# EAGLE design mapleCUx_large_034 (EAGLE 6.6.0)
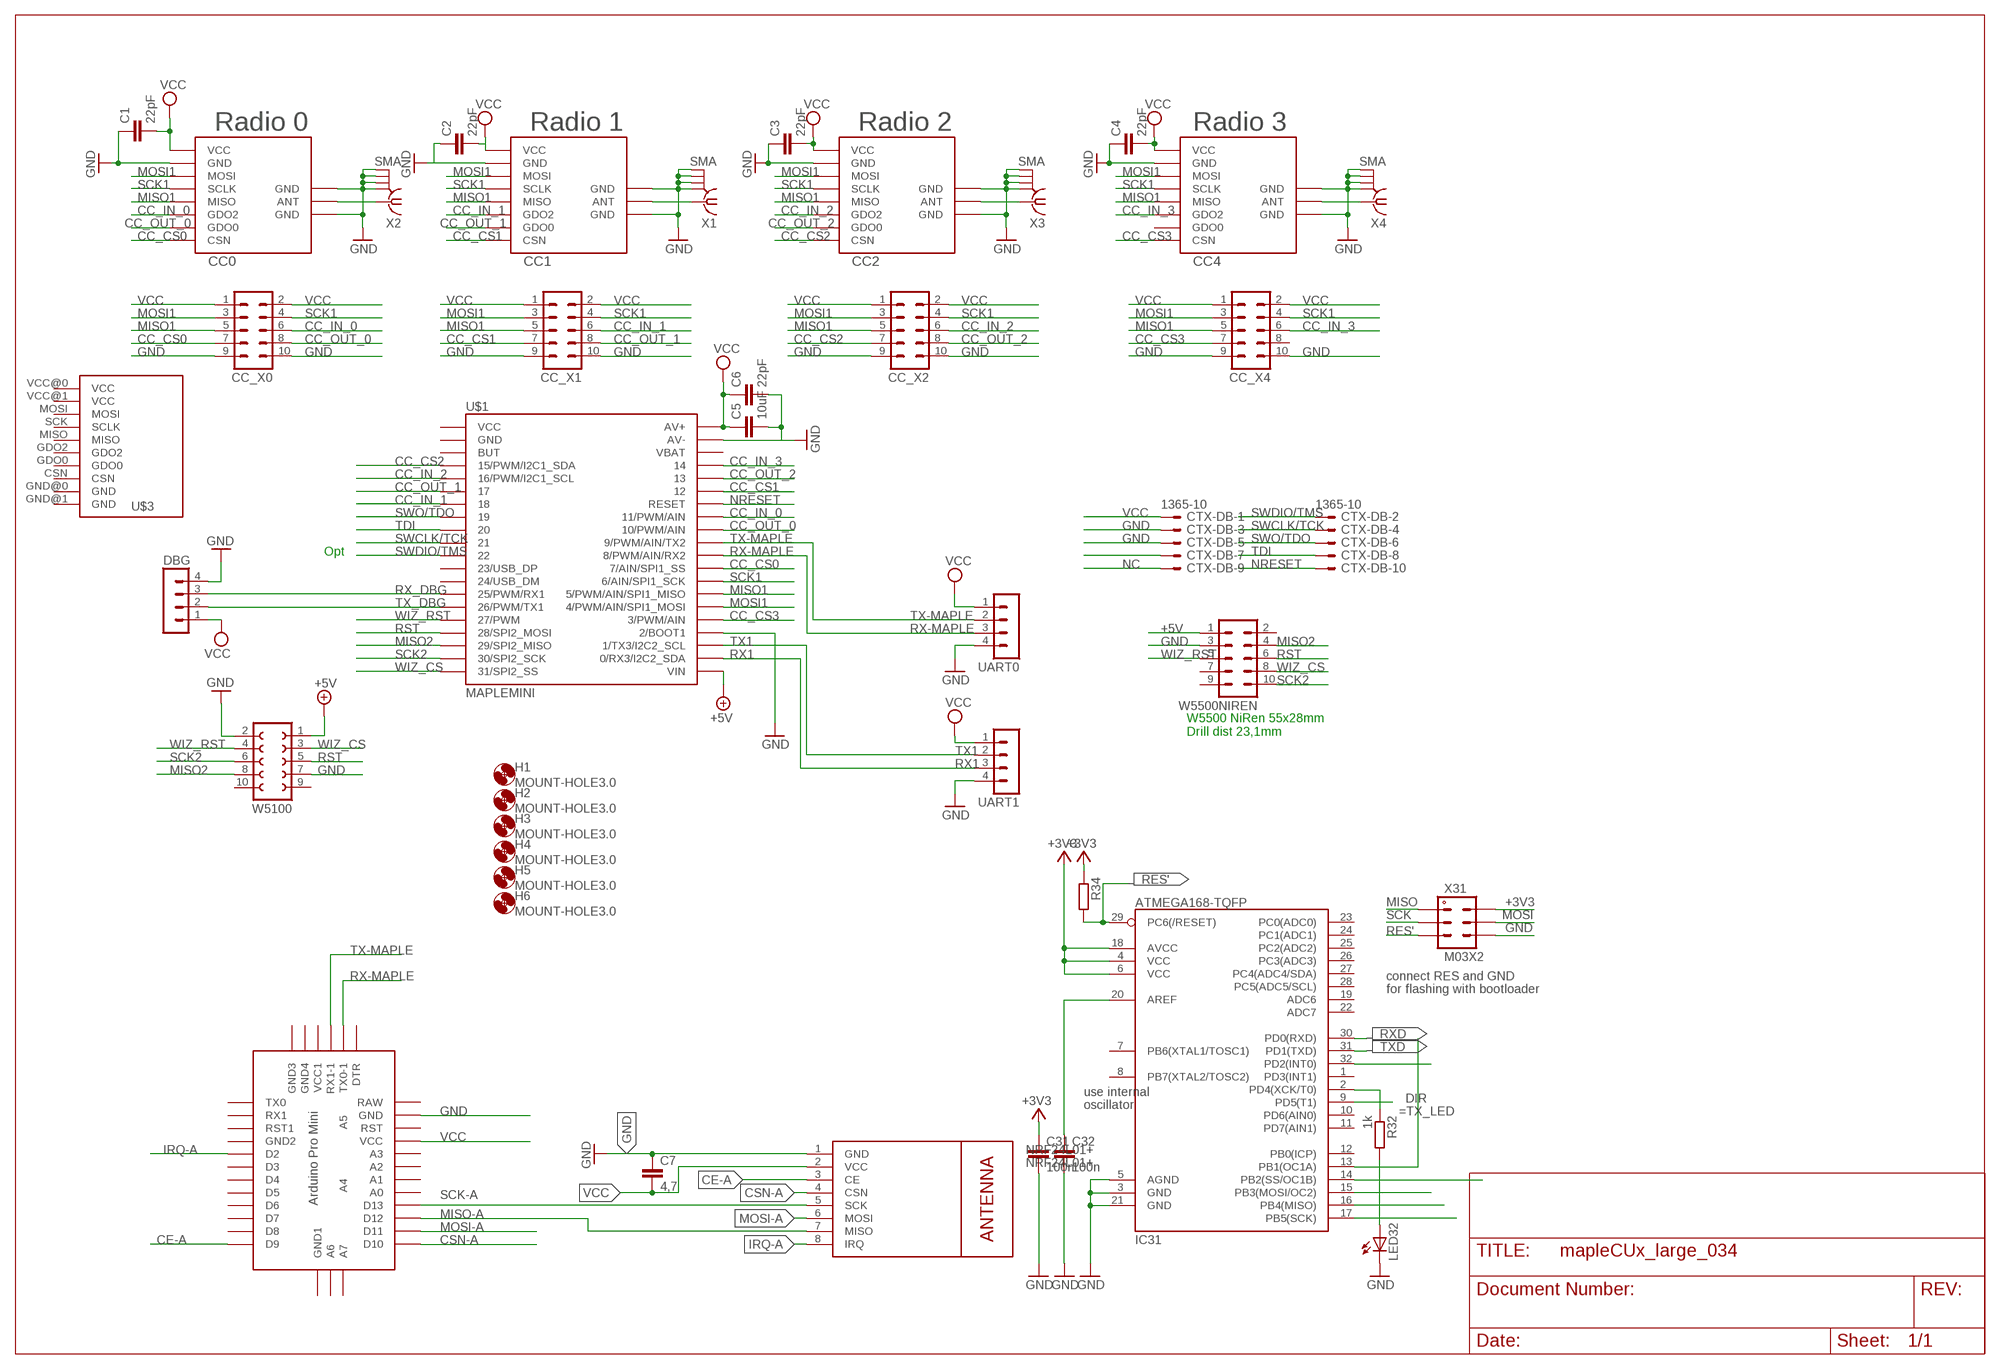
[diagram p0: schematic, sheet 1]

## Parts
C1  22pF  C-EUC0805  [C0805]
C2  22pF  C-EUC0805  [C0805]
C3  22pF  C-EUC0805  [C0805]
C4  22pF  C-EUC0805  [C0805]
C5  10uF  C-EUC1210  [C1210]
C6  22pF  C-EUC0805  [C0805]
C7  4,7  C-EUC1210  [C1210]
C31  100n  C-EUC0805  [C0805]
C32  100n  C-EUC0805  [C0805]
CC0  CC1101_MODULE1SMD  [CC1101_MODULE1_SMD]
CC1  CC1101_MODULE1SMD  [CC1101_MODULE1_SMD]
CC2  CC1101_MODULE1SMD  [CC1101_MODULE1_SMD]
CC4  CC1101_MODULE1SMD  [CC1101_MODULE1_SMD]
CC_X0  MA05-2  [MA05-2]
CC_X1  MA05-2  [MA05-2]
CC_X2  MA05-2  [MA05-2]
CC_X4  MA05-2  [MA05-2]
CTX-DB  1365-10  [1365-10]
DBG  MA04-1  [MA04-1]
H1  MOUNT-HOLE3.0  [3,0]
H2  MOUNT-HOLE3.0  [3,0]
H3  MOUNT-HOLE3.0  [3,0]
H4  MOUNT-HOLE3.0  [3,0]
H5  MOUNT-HOLE3.0  [3,0]
H6  MOUNT-HOLE3.0  [3,0]
IC31  ATMEGA168-TQFP  [TQFP32-08]
LED32  LEDCHIPLED_0805  [CHIPLED_0805]
NRF24L01+  NRF24L01+  WIRELESS-NRF24L01  [WIRELESS-NRF24L01]
R32  1k  R-EU_R0805  [R0805]
R34  R-EU_R0805  [R0805]
U$1  MAPLEMINI  [20-DIP]
U$2  ABK-PRO-MINI  [ABK-PRO-MINI]
U$3  CC1101_MODULE3_DIL  [CC1101_MODULE3_DIL]
UART0  MA04-1  [MA04-1]
UART1  MA04-1  [MA04-1]
W5100  FE05-2  [FE05-2]
W5500NIREN  MA05-2  [MA05-2]
X1  SMA  [SMA]
X2  SMA  [SMA]
X3  SMA  [SMA]
X4  SMA  [SMA]
X31  M03X2  [2X03-1.27MM_SMD]

## Nets
+3V3: C31.1 IC31.4(VCC) IC31.6(VCC) IC31.18(AVCC) R34.1 X31.P$2
+5V: U$1.21(VIN) W5100.1 W5500NIREN.1
CC_CS0: CC0.CSN CC_X0.7 U$1.29(7/AIN/SPI1_SS)
CC_CS1: CC1.CSN CC_X1.7 U$1.35
CC_CS2: CC2.CSN CC_X2.7 U$1.4(15/PWM/I2C1_SDA)
CC_CS3: CC4.CSN CC_X4.7 U$1.25(3/PWM/AIN)
CC_IN_0: CC0.GDO2 CC_X0.6 U$1.33(11/PWM/AIN)
CC_IN_1: CC1.GDO2 CC_X1.6 U$1.7
CC_IN_2: CC2.GDO2 CC_X2.6 U$1.5(16/PWM/I2C1_SCL)
CC_IN_3: CC4.GDO2 CC_X4.6 U$1.37
CC_OUT_0: CC0.GDO0 CC_X0.8 U$1.32(10/PWM/AIN)
CC_OUT_1: CC1.GDO0 CC_X1.8 U$1.6
CC_OUT_2: CC2.GDO0 CC_X2.8 U$1.36
CE-A: NRF24L01+.3(CE) U$2.D9
CS: IC31.14(PB2(SS/OC1B))
CSN-A: NRF24L01+.4(CSN) U$2.D10
DIR: IC31.9(PD5(T1))
GND: C1.1 C2.1 C3.1 C4.1 C5.2 C6.2 C7.1 C31.2 C32.2 CC0.GND@0(GND) CC0.GND@1(GND) CC0.GND@2(GND) CC1.GND@0(GND) CC1.GND@1(GND) CC1.GND@2(GND) CC2.GND@0(GND) CC2.GND@1(GND) CC2.GND@2(GND) CC4.GND@0(GND) CC4.GND@1(GND) CC4.GND@2(GND) CC_X0.9 CC_X0.10 CC_X1.9 CC_X1.10 CC_X2.9 CC_X2.10 CC_X4.9 CC_X4.10 CTX-DB.3 CTX-DB.5 DBG.4 IC31.3(GND) IC31.5(AGND) IC31.21(GND) LED32.C NRF24L01+.1(GND) U$1.24(2/BOOT1) U$1.39(AV-) U$2.GND UART0.4 UART1.4 W5100.2 W5100.7 W5500NIREN.3 X1.GND@1 X1.GND@2 X1.GND@3 X1.GND@4 X2.GND@1 X2.GND@2 X2.GND@3 X2.GND@4 X3.GND@1 X3.GND@2 X3.GND@3 X3.GND@4 X4.GND@1 X4.GND@2 X4.GND@3 X4.GND@4 X31.P$6
IRQ-A: NRF24L01+.8(IRQ) U$2.D2
MISO: IC31.16(PB4(MISO)) X31.P$1
MISO1: CC0.MISO CC1.MISO CC2.MISO CC4.MISO CC_X0.5 CC_X1.5 CC_X2.5 CC_X4.5 U$1.27(5/PWM/AIN/SPI1_MISO)
MISO2: U$1.18(29/SPI2_MISO) W5100.8 W5500NIREN.4
MISO-A: NRF24L01+.7(MISO) U$2.D12
MOSI: IC31.15(PB3(MOSI/OC2)) X31.P$4
MOSI1: CC0.MOSI CC1.MOSI CC2.MOSI CC4.MOSI CC_X0.3 CC_X1.3 CC_X2.3 CC_X4.3 U$1.26(4/PWM/AIN/SPI1_MOSI)
MOSI-A: NRF24L01+.6(MOSI) U$2.D11
N$1: CC2.ANT X3.1
N$2: CC4.ANT X4.1
N$3: CC1.ANT X1.1
N$4: CC0.ANT X2.1
N$5: LED32.A R32.2
N$6: IC31.13(PB1(OC1A))
N$8: CTX-DB.7
N$13: IC31.32(PD2(INT0))
N$15: C32.1 IC31.20(AREF)
NC: CTX-DB.9
NRESET: CTX-DB.10 U$1.34(RESET)
RES': IC31.29(PC6(/RESET)) R34.2 X31.P$5
RST: U$1.17(28/SPI2_MOSI) W5100.5 W5500NIREN.6
RX1: U$1.22(0/RX3/I2C2_SDA) UART1.3
RX-MAPLE: U$1.30(8/PWM/AIN/RX2) U$2.TX0-1 UART0.3
RX_DBG: DBG.3 U$1.14(25/PWM/RX1)
RX_LED: IC31.2(PD4(XCK/T0)) R32.1
RXD: IC31.30(PD0(RXD))
SCK: IC31.17(PB5(SCK)) X31.P$3
SCK1: CC0.SCLK CC1.SCLK CC2.SCLK CC4.SCLK CC_X0.4 CC_X1.4 CC_X2.4 CC_X4.4 U$1.28(6/AIN/SPI1_SCK)
SCK2: U$1.19(30/SPI2_SCK) W5100.6 W5500NIREN.10
SCK-A: NRF24L01+.5(SCK) U$2.D13
SWCLK/TCK: CTX-DB.4 U$1.10
SWDIO/TMS: CTX-DB.2 U$1.11
SWO/TDO: CTX-DB.6 U$1.8
TDI: CTX-DB.8 U$1.9
TX1: U$1.23(1/TX3/I2C2_SCL) UART1.2
TX-MAPLE: U$1.31(9/PWM/AIN/TX2) U$2.RX1-1 UART0.2
TX_DBG: DBG.2 U$1.15(26/PWM/TX1)
TXD: IC31.31(PD1(TXD))
VCC: C1.2 C2.2 C3.2 C4.2 C5.1 C6.1 C7.2 CC0.VCC CC1.VCC CC2.VCC CC4.VCC CC_X0.1 CC_X0.2 CC_X1.1 CC_X1.2 CC_X2.1 CC_X2.2 CC_X4.1 CC_X4.2 CTX-DB.1 DBG.1 NRF24L01+.2(VCC) U$1.40(AV+) U$2.VCC UART0.1 UART1.1
WIZ_CS: U$1.20(31/SPI2_SS) W5100.3 W5500NIREN.8
WIZ_RST: U$1.16(27/PWM) W5100.4 W5500NIREN.5
Unconnected: CC4.GDO0 CC_X4.8 IC31.1(PD3(INT1)) IC31.7(PB6(XTAL1/TOSC1)) IC31.8(PB7(XTAL2/TOSC2)) IC31.10(PD6(AIN0)) IC31.11(PD7(AIN1)) IC31.12(PB0(ICP)) IC31.19(ADC6) IC31.22(ADC7) IC31.23(PC0(ADC0)) IC31.24(PC1(ADC1)) IC31.25(PC2(ADC2)) IC31.26(PC3(ADC3)) IC31.27(PC4(ADC4/SDA)) IC31.28(PC5(ADC5/SCL)) U$1.1(VCC) U$1.2(GND) U$1.3(BUT) U$1.12(23/USB_DP) U$1.13(24/USB_DM) U$1.38(VBAT) U$2.A0 U$2.A1 U$2.A2 U$2.A3 U$2.A4 U$2.A5 U$2.A6 U$2.A7 U$2.D3 U$2.D4 U$2.D5 U$2.D6 U$2.D7 U$2.D8 U$2.DTR U$2.GND1(GND2) U$2.GND2(GND3) U$2.GND3(GND4) U$2.GND4(GND1) U$2.RAW U$2.RST U$2.RST1 U$2.RX1 U$2.TX0 U$2.VCC1 U$3.CSN U$3.GDO0 U$3.GDO2 U$3.MISO U$3.MOSI U$3.SCK(SCLK) W5100.9 W5100.10 W5500NIREN.2 W5500NIREN.7 W5500NIREN.9

## Notes on the sheet
- Radio 0 | Radio 1 | Radio 2 | Radio 3
- Opt
- W5500 NiRen 55x28mm
  Drill dist 23,1mm
- connect RES and GND
- for flashing with bootloader
- use internal
- oscillator
- =TX_LED

## Power pins joined to a net without a drawn wire
GND: U$3.GND@0(GND) U$3.GND@1(GND)
VCC: U$3.VCC@0(VCC) U$3.VCC@1(VCC)

## Library data of the parts
C1-C7 C31 C32 = rcl:C-EU: CAPACITOR, European symbol
CC0 CC1 CC2 CC4 = wireless:CC1101_MODULE1: CC1101 wireless module for 433/868 MHz (sold from Aliexpress). DIL version for mounting with pin header (and SMD soldering) and SMD only variant available.
CC_X0 CC_X1 CC_X2 CC_X4 W5500NIREN = con-lstb:MA05-2: PIN HEADER; OC_FARNELL: unknown; OC_NEWARK: unknown
CTX-DB = con-leotronics:1365-10: DUAL ROW STRAIGHT HEADER 1364 SERIES. 1.27mm x 1.27mm. Without Fixing Post. SMT Source: http://www.leotronics.co.uk/Conexcon/Data%20Sheets/sec.%20A/1364ing.pdf; OC_FARNELL: unknown; OC_NEWARK: unknown
DBG UART0 UART1 = con-lstb:MA04-1: PIN HEADER; OC_FARNELL: unknown; OC_NEWARK: unknown
H1-H6 = holes:MOUNT-HOLE: MOUNTING HOLE with drill center marker
IC31 = atmel:ATMEGA168: Atmel Atmega 168/328/328P
LED32 = led:LED: LED OSRAM: - CHIPLED LG R971, LG N971, LY N971, LG Q971, LY Q971, LO R971, LY R971 LH N974, LH R974 LS Q976, LO Q976, LY Q976 LO Q996 - Hyper CHIPLED LW Q18S LB Q993, LB Q99A, LB R99A - SideLED LS A670, LO A670, LY A670, LG A670, LP A670 LB A673, LV A673, LT A673, LW A673 LH A674 LY A675 LS A676, LA A676, LO A676, LY A676, LW A676 LS A679, LY A679, LG A679 - Hyper Micro SIDELED® LS Y876, LA Y876, LO Y876, LY Y876 LT Y87S - SmartLED LW L88C, LW L88S LB L89C, LB L89S, LG L890 LS L89K, LO L89K, LY L89K LS L896, LA L896, LO L896, LY L896 - TOPLED LS T670, LO T670, LY T670, LG T670, LP T670 LSG T670, LSP T670, LSY T670, LOP T670, LYG T670 LG T671, LOG T671, LSG T671 LB T673, LV T673, LT T673, LW T673 LH T674 LS T676, LA T676, LO T676, LY T676, LB T676, LH T676, LSB T676, LW T676 LB T67C, LV T67C, LT T67C, LS T67K, LO T67K, LY T67K, LW E67C LS E67B, LA E67B, LO E67B, LY E67B, LB E67C, LV E67C, LT E67C LW T67C LS T679, LY T679, LG T679 LS T770, LO T770, LY T770, LG T770, LP T770 LB T773, LV T773, LT T773, LW T773 LH T774 LS E675, LA E675, LY E675, LS T675 LS T776, LA T776, LO T776, LY T776, LB T776 LHGB T686 LT T68C, LB T68C - Hyper Mini TOPLED® LB M676 - Mini TOPLED Santana® LG M470 LS M47K, LO M47K, LY M47K Source: http://www.osram.convergy.de/
NRF24L01+ = diy-modules:WIRELESS-NRF24L01: 2.4 GHz Wireless Module based on NRF24L01 chip
R32 R34 = rcl:R-EU_: RESISTOR, European symbol
U$1 = maplemini-small:MAPLEMINI
U$2 = Arduino-clone:ABK-PRO-MINI: ABK Pro-Mini Arduino Clone
U$3 = wireless:CC1101_MODULE3_DIL: 433 Mhz CC1101 wireless module named RF1101SE V3.1 package special has only limited silk screen on tPlace layer
W5100 = con-lsta:FE05-2: FEMALE HEADER; OC_FARNELL: unknown; OC_NEWARK: unknown
X1-X4 = sma:SMA: SMA 50 Ohm end launch jack receptacle - round contact
X31 = mechanics:M03X2

## Net classes
1 PWR: width 0.305 mm

## Board
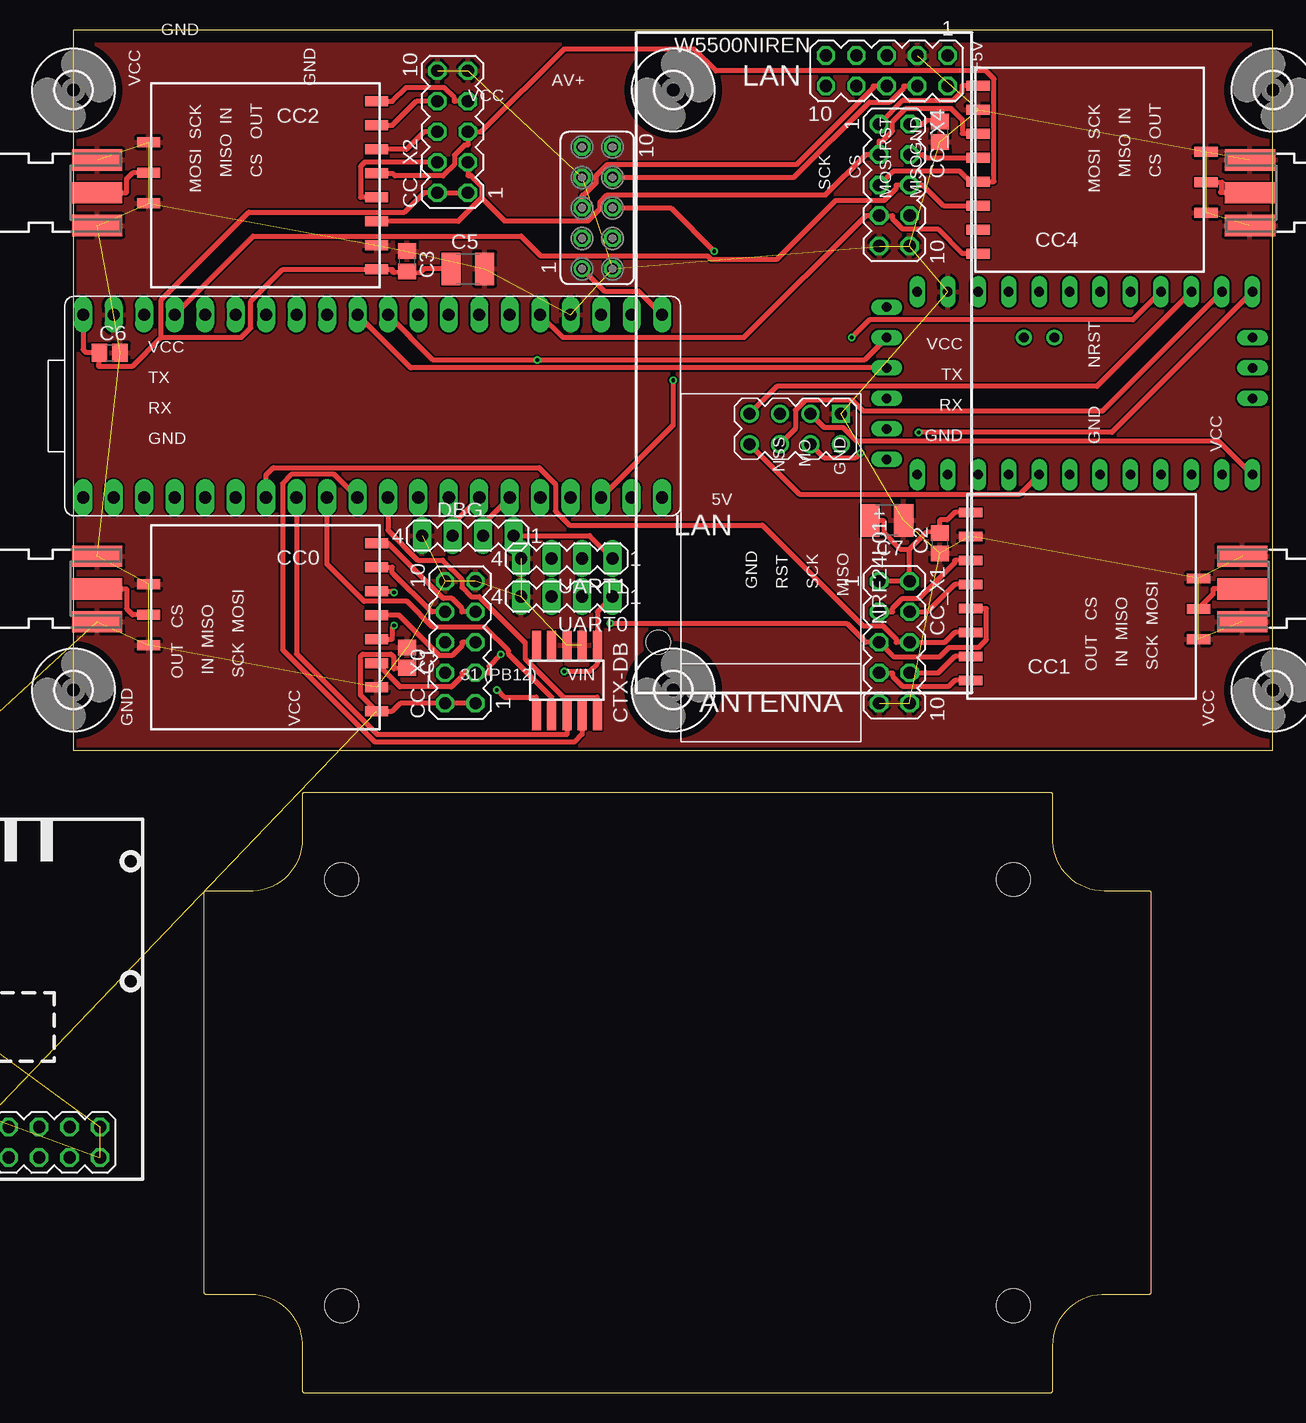
[diagram p1: board, top side]
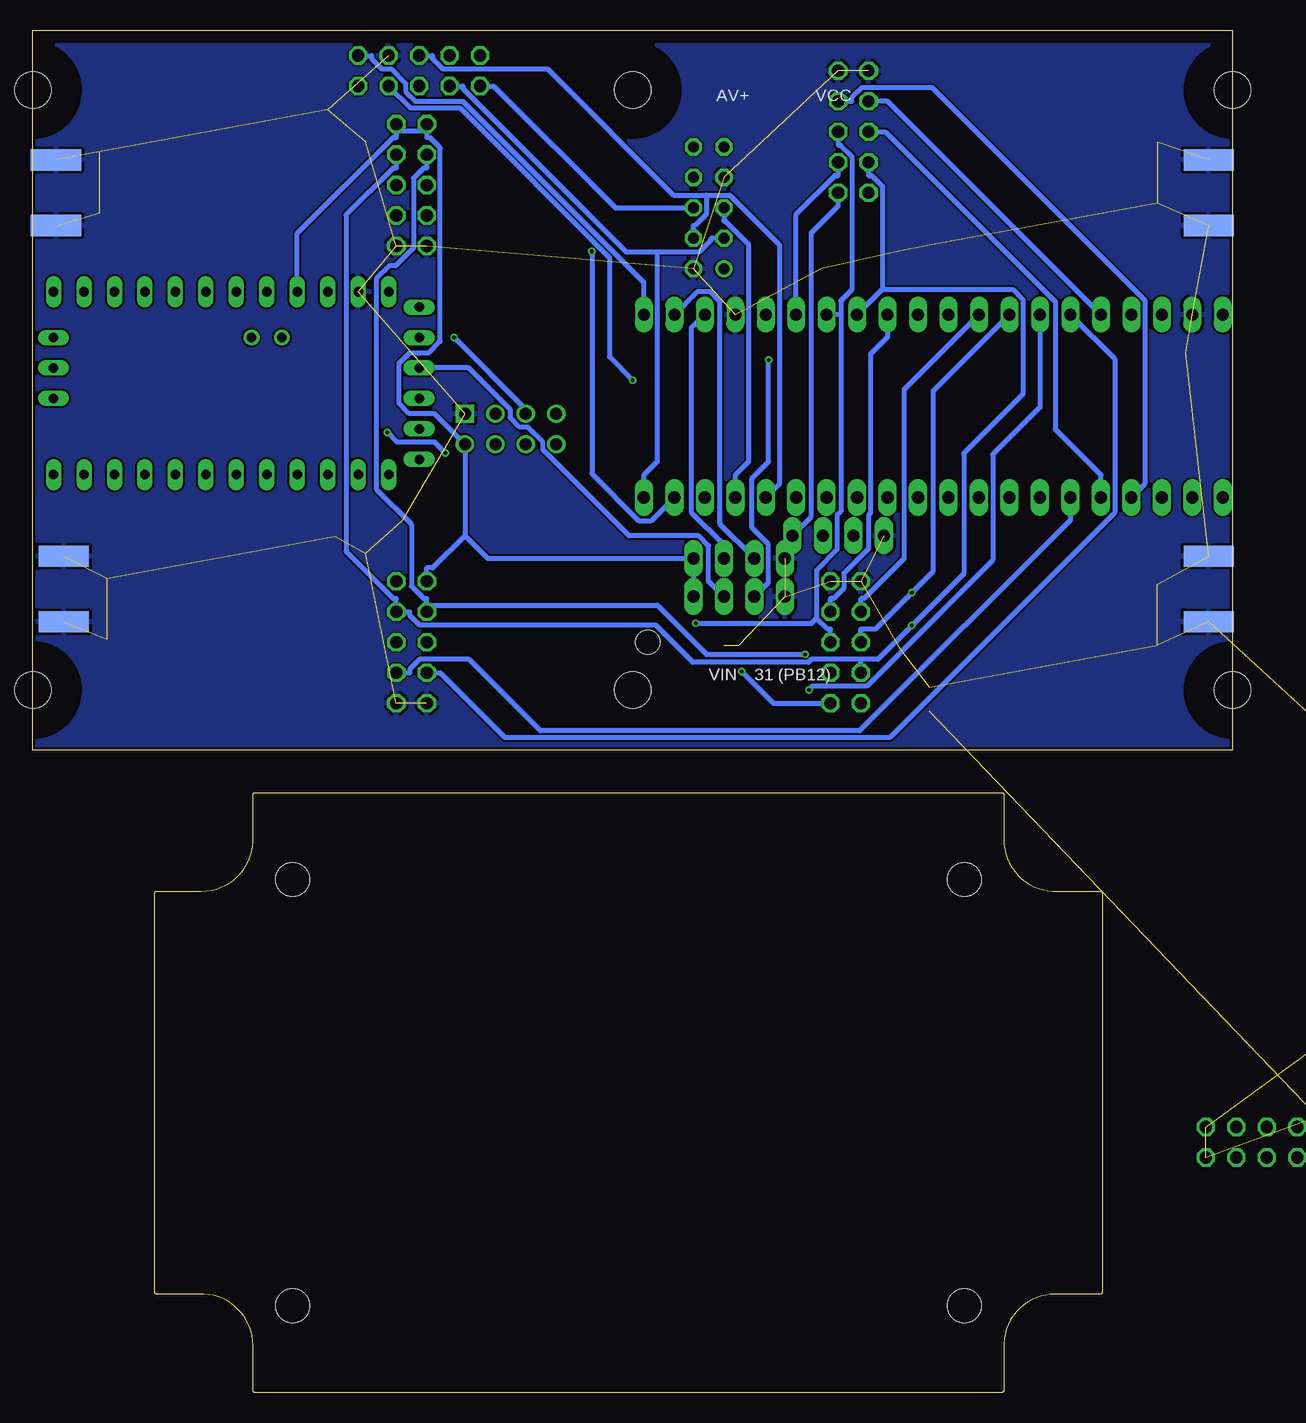
[diagram p2: board, bottom side, seen from below]

Size 100 x 113.55 mm. Coordinates in mm from the lower left corner, seen from the top.
Outline: 0,113.55 0,53.55 100,53.55 100,113.55 0,113.55
Outline: 14.56,41.8 11.06,41.8 arc90 10.86,41.6 10.86,8.4 arc90 11.06,8.2 14.76,8.2 arc-94 19.06,3.7 19.06,0.2 arc90 19.26,0 81.46,0 arc90 81.66,0.2 81.66,3.9 arc-94 86.16,8.2 89.66,8.2 arc90 89.86,8.4 89.86,41.6 arc90 89.66,41.8 85.96,41.8 arc-94 81.66,46.3 81.66,49.8 arc90 81.46,50 19.26,50 arc90 19.06,49.8 19.06,46.1 arc-94 14.56,41.8
Copper layers (1*16): Top 0.035mm / dielectric 1.5mm / Bottom 0.035mm
Design rules "SeeedStudio_2layer_DRU_no_angle_20140221": minimum track width 6mil, minimum drill 12mil, track to track 6mil, track to pad 6mil, pad to pad 6mil, via to via 6mil, smd to smd 0mil, copper to edge 10mil, drill to drill 10mil, minimum pad ring 10mil, minimum via ring 6mil, stop-mask expansion 2mil, vias tented up to drill 100mil, thermal gap 10mil
Holes 2 mm at 48.76,62.52
Holes 2.8 mm at 22.36,7.25 78.36,7.25 22.36,42.75 78.36,42.75
tRestrict: area -0.1,112.7 to 100.2,113.3
bRestrict: area -0.1,112.7 to 100.2,113.3

### Footprints (pad centres in the part's own frame; a part is rotated, then mirrored left to right if it is on the bottom)
C0805 = smd 1.3 x 1.5: 1 -0.85,0; 2 0.85,0
C1210 = smd 1.6 x 2.7: 1 -1.4,0; 2 1.4,0
CC1101_MODULE1_SMD = smd 1.93 x 0.813: ANT 19,5.96; CSN 0,0; GDO0 0,2; GDO2 0,4; GND@0 0,12; GND@1 19,8.5; GND@2 19,3.42; MISO 0,6; MOSI 0,10; SCLK 0,8; VCC 0,14
MA05-2 = drill 1.016 octagon: 1 -5.08,-1.27; 2 -5.08,1.27; 3 -2.54,-1.27; 4 -2.54,1.27; 5 0,-1.27; 6 0,1.27; 7 2.54,-1.27; 8 2.54,1.27; 9 5.08,-1.27; 10 5.08,1.27
1365-10 = smd 0.76 x 2.4: 1 -2.54,-2.95; 2 -2.54,2.95; 3 -1.27,-2.95; 4 -1.27,2.95; 5 0,-2.95; 6 0,2.95; 7 1.27,-2.95; 8 1.27,2.95; 9 2.54,-2.95; 10 2.54,2.95
MA04-1 = drill 1.016 long: 1 -3.81,0; 2 -1.27,0; 3 1.27,0; 4 3.81,0
3,0 = hole 3: 0,0
TQFP32-08 = smd 1.27 x 0.559: 1 -4.293,2.8; 2 -4.293,2; 3 -4.293,1.2; 4 -4.293,0.4; 5 -4.293,-0.4; 6 -4.293,-1.2; 7 -4.293,-2; 8 -4.293,-2.8; 17 4.293,-2.8; 18 4.293,-2; 19 4.293,-1.2; 20 4.293,-0.4; 21 4.293,0.4; 22 4.293,1.2; 23 4.293,2; 24 4.293,2.8 | smd 0.559 x 1.27: 9 -2.8,-4.293; 10 -2,-4.293; 11 -1.2,-4.293; 12 -0.4,-4.293; 13 0.4,-4.293; 14 1.2,-4.293; 15 2,-4.293; 16 2.8,-4.293; 25 2.8,4.293; 26 2,4.293; 27 1.2,4.293; 28 0.4,4.293; 29 -0.4,4.293; 30 -1.2,4.293; 31 -2,4.293; 32 -2.8,4.293
CHIPLED_0805 = smd 1.2 x 1.2: A 0,-1.05; C 0,1.05
WIRELESS-NRF24L01 = drill 1 square: 1 -12.7,6.35 | drill 1: 2 -10.16,6.35; 3 -12.7,3.81; 4 -10.16,3.81; 5 -12.7,1.27; 6 -10.16,1.27; 7 -12.7,-1.27; 8 -10.16,-1.27
R0805 = smd 1.3 x 1.5: 1 -0.85,0; 2 0.85,0
20-DIP = drill 1.016 pad 1.27 long: 1 -24.13,-7.62; 2 -21.59,-7.62; 3 -19.05,-7.62; 4 -16.51,-7.62; 5 -13.97,-7.62; 6 -11.43,-7.62; 7 -8.89,-7.62; 8 -6.35,-7.62; 9 -3.81,-7.62; 10 -1.27,-7.62; 11 1.27,-7.62; 12 3.81,-7.62; 13 6.35,-7.62; 14 8.89,-7.62; 15 11.43,-7.62; 16 13.97,-7.62; 17 16.51,-7.62; 18 19.05,-7.62; 19 21.59,-7.62; 20 24.13,-7.62 | drill 1 pad 1.27 long: 21 24.13,7.62; 22 21.59,7.62; 23 19.05,7.62; 24 16.51,7.62; 25 13.97,7.62; 26 11.43,7.62; 27 8.89,7.62; 28 6.35,7.62; 29 3.81,7.62; 30 1.27,7.62; 31 -1.27,7.62; 32 -3.81,7.62; 33 -6.35,7.62; 34 -8.89,7.62; 35 -11.43,7.62; 36 -13.97,7.62; 37 -16.51,7.62; 38 -19.05,7.62; 39 -21.59,7.62; 40 -24.13,7.62
ABK-PRO-MINI = drill 0.8 long: A0 10.16,-3.81; A1 10.16,-6.35; A2 10.16,-8.89; A3 10.16,-11.43; A6 3.81,-21.59; A7 6.35,-21.59; D2 -5.08,-3.81; D3 -5.08,-6.35; D4 -5.08,-8.89; D5 -5.08,-11.43; D6 -5.08,-13.97; D7 -5.08,-16.51; D8 -5.08,-19.05; D9 -5.08,-21.59; D10 10.16,-21.59; D11 10.16,-19.05; D12 10.16,-16.51; D13 10.16,-13.97; DTR 8.89,8.89; GND 10.16,3.81; GND1 -5.08,-1.27; GND2 -3.81,8.89; GND3 -1.27,8.89; GND4 1.27,-21.59; RAW 10.16,6.35; RST 10.16,1.27; RST1 -5.08,1.27; RX1 -5.08,3.81; RX1-1 3.81,8.89; TX0 -5.08,6.35; TX0-1 6.35,8.89; VCC 10.16,-1.27; VCC1 1.27,8.89 | drill 0.8: A4 6.35,-5.08; A5 6.35,-2.54
CC1101_MODULE3_DIL = drill 1.016 octagon: CSN 1.81,6.1; GDO0 4.35,6.1; GDO2 4.35,8.64; GND@0 1.81,3.56; GND@1 4.35,3.56; MISO 1.81,8.64; MOSI 1.81,11.18; SCK 4.35,11.18; VCC@0 1.81,13.72; VCC@1 4.35,13.72
FE05-2 = drill 0.914: 1 -5.08,1.27 | drill 0.914 octagon: 2 -5.08,-1.27; 3 -2.54,1.27; 4 -2.54,-1.27; 5 0,1.27; 6 0,-1.27; 7 2.54,1.27; 8 2.54,-1.27; 9 5.08,1.27; 10 5.08,-1.27
SMA = smd 4.191 x 1.778: 1 2.115,0; GND@1 2.115,2.733; GND@2 2.115,-2.733 | smd 4.191 x 1.778 bottom: GND@3 2.115,2.733; GND@4 2.115,-2.733
2X03-1.27MM_SMD = smd 0.75 x 2.8: P$1 -1.27,-1.905; P$2 -1.27,1.905; P$3 0,-1.905; P$4 0,1.905; P$5 1.27,-1.905; P$6 1.27,1.905

### Placement (x,y rotation side)
C1  27.8,61.26 270 top
C2  72.25,70.78 90 top
C3  27.8,94.28 270 top
C4  72.25,105.07 90 top
C5  32.88,93.64 0 top
C6  3.03,86.66 0 top
C7  67.81,72.69 180 top
C31  -17.08,35.56 0 top  (outside the outline)
C32  -17.08,40.64 0 top  (outside the outline)
CC0  25.26,70.78 180 top
CC1  74.79,59.35 0 top
CC2  25.26,107.61 180 top
CC4  75.42,94.91 0 top
CC_X0  32.25,62.52 90 top
CC_X1  68.44,62.52 270 top
CC_X2  31.61,105.07 90 top
CC_X4  68.44,100.62 270 top
CTX-DB  41.13,59.35 180 top
DBG  32.88,71.42 180 top
H1  100,58.55 0 top
H2  100,108.55 90 top
H3  0,58.55 0 top
H4  0,108.55 0 top
H5  50,58.55 0 top
H6  50,108.55 0 top
IC31  -24.7,43.18 0 top  (outside the outline)
LED32  -17.08,45.72 0 top  (outside the outline)
NRF24L01+  57.64,68.88 270 top
R32  -22.16,33.02 0 top  (outside the outline)
R34  -27.24,33.02 0 top  (outside the outline)
U$1  24.94,82.21 0 top
U$2  76.69,81.58 90 top
U$3  5.78,17.78 90 top
UART0  41.13,66.33 180 top
UART1  41.13,69.51 180 top
W5100  43.67,98.72 90 top
W5500NIREN  67.81,110.15 180 top
X1  99.55,66.97 180 top
X2  -0.14,66.97 0 top
X3  -0.14,99.99 0 top
X4  100.19,99.99 180 top
X31  -22.16,27.94 90 top  (outside the outline)

### Tracks (layer width: path | path; a pad name or v marks a point on that pad's centre or on a via)
+3V3  (5 unrouted)
+5V
  Top 0.406: W5100.1 44.26,91.79 47.12,91.79 U$1.21
  Bottom 0.406: U$1.21 49.07,92.51 64.18,107.61 68.12,107.61 68.92,108.41 68.92,109.08 70.14,110.3 70.93,110.3 71.77,111.14 71.77,111.42 W5500NIREN.1
CC_CS0
  Top 0.406: CC_X0.7 32.4,65.06 32.4,65.34 31.56,66.18 30.82,66.18 26.22,70.78 CC0.CSN
  Bottom 0.406: U$1.29 28.75,87.97 30.17,86.55 30.17,73.29 30.34,73.12 30.34,70.34 32.4,68.28 32.4,67.03 33.24,66.18 33.52,66.18 CC_X0.7
CC_CS1
  Top 0.406: CC1.CSN 73.47,59.35 72.98,58.87 69.13,58.87 68.29,59.71 68.29,59.98 CC_X1.7
  Bottom 0.406: CC_X1.7 66.05,59.98 60.65,54.58 28.57,54.58 9.82,73.32 9.82,86.14 U$1.35
CC_CS2
  Top 0.406: CC2.CSN 26.58,107.61 27.71,108.74 30.91,108.74 31.76,107.89 31.76,107.61 CC_X2.7
  Bottom 0.406: CC_X2.7 31.76,107.61 31.76,107.88 30.9,108.74 25.02,108.74 7.28,91 7.28,75.74 U$1.4
CC_CS3
  Top 0.406: U$1.25 40.8,87.95 55.91,87.95 66.05,98.08 CC_X4.7 68.29,98.08 68.29,97.81 69.13,96.97 72.05,96.97 74.1,94.91 CC4.CSN
CC_IN_0  (via drill 0.3 pad 0.61)
  Top 0.406: CC0.GDO2 26.58,66.78 26.7,66.66 v26.73,66.66
  Bottom 0.406: U$1.33 24.94,83.48 24.94,68.45 v26.73,66.66 29.75,63.64 30.97,63.64 CC_X0.6
CC_IN_1
  Top 0.406: U$1.7 16.05,76.47 16.66,77.07 38.83,77.07 40.18,75.72 40.18,73.46 41.35,72.3 57.44,72.3 65.82,63.91 67.48,63.91 68.59,62.8 68.59,62.52 CC_X1.6 72.64,62.52 73.47,63.35 CC1.GDO2
CC_IN_2
  Top 0.406: CC_X2.6 29.22,105.07 27.76,103.61 CC2.GDO2
  Bottom 0.406: U$1.5 10.97,76.47 14.78,80.28 14.78,90.91 28.94,105.07 CC_X2.6
CC_IN_3
  Top 0.406: U$1.37 14.97,96.37 37.32,96.37 38.96,94.73 52.86,94.73 53.13,94.46 58.65,94.46 63.55,99.36 67.6,99.36 68.59,100.35 68.59,100.62 CC_X4.6 70.83,100.62 72.54,98.91 CC4.GDO2
CC_OUT_0
  Top 0.406: CC0.GDO0 26.58,68.78 26.58,68.34 29.86,65.06 CC_X0.8
  Bottom 0.406: CC_X0.8 30.97,66.18 30.7,66.18 27.38,69.5 27.38,83.58 U$1.32
CC_OUT_1
  Top 0.406: CC1.GDO0 73.47,61.35 72.1,59.98 CC_X1.8
  Bottom 0.406: U$1.6 13.51,72.71 31.08,55.14 57.69,55.14 63.65,61.1 67.75,61.1 68.59,60.26 68.59,59.98 CC_X1.8
CC_OUT_2
  Top 0.406: CC2.GDO0 26.58,105.61 28.58,107.61 CC_X2.8
  Bottom 0.406: U$1.36 28.75,107.61 CC_X2.8
CE-A
  Top 0.406: U$2.D9 95.48,79.3 65.3,79.3 64.17,80.42 62.61,80.42 NRF24L01+.3
CSN-A  (via drill 0.3 pad 0.61)
  Top 0.406: v65.62,78.31 65.19,77.87 62.62,77.87 NRF24L01+.4 | U$2.D10 86.57,80.02 v70.45,80.02
  Bottom 0.406: v70.45,80.02 69.67,79.23 66.55,79.23 v65.62,78.31
GND  (63 unrouted)
  pour Bottom: -0.14,113.33 -0.14,53.63 100.19,53.63 100.19,113.33
  pour Top: -0.14,53.63 -0.14,113.33 100.19,113.33 100.19,53.63
IRQ-A
  Top 0.406: U$2.D2 78.84,74.83 60.58,74.83 NRF24L01+.8
MISO  (1 unrouted)
MISO1  (via drill 0.3 pad 0.61)
  Top 0.406: v44.75,64.11 64.47,64.11 66.05,62.52 CC_X1.5 68.35,61.34 72.25,61.34 73.02,62.11 75.47,62.11 76.11,62.75 76.11,65.35 CC1.MISO | CC_X0.5 32.4,62.52 32.4,62.25 31.56,61.4 30.5,61.4 27.13,64.78 CC0.MISO | CC2.MISO 26.58,101.61 26.8,101.39 30.83,101.39 31.76,102.33 31.76,103.11 32.6,103.95 32.88,103.95 CC_X2.5 34,105.07 40.89,111.96 51.75,111.96 53.56,110.15 76.07,110.15 76.75,109.47 76.75,100.91 CC4.MISO 74.77,100.91 73.9,101.77 68.32,101.77 CC_X4.5
  Bottom 0.406: 34.67,64.53 33.79,63.64 33.52,63.64 CC_X0.5 | 32.66,89.83 32.66,73.42 32.96,73.12 32.96,70.26 34.67,68.55 34.67,64.53 | v44.75,64.11 35.09,64.11 34.67,64.53 | 32.66,89.83 U$1.27 | 32.66,89.83 32.66,91 31.75,91.92 31.75,103.03 32.67,103.95 32.88,103.95 CC_X2.5
MISO2  (via drill 0.3 pad 0.61)
  Top 0.406: v50,84.37 50,80.6 U$1.18 | W5100.8 60.06,101.26 66.34,107.54 68.05,107.54 69.23,108.72 69.23,108.88 W5500NIREN.4
  Bottom 0.406: W5500NIREN.4 68.52,107.05 64.41,107.05 51.94,94.59 51.94,86.31 v50,84.37
MISO-A
  Top 0.406: U$2.D12 85.33,83.86 58.66,83.86 NRF24L01+.7
MOSI  (1 unrouted)
MOSI1  (via drill 0.3 pad 0.61)
  Top 0.406: v35.62,61.52 34.63,60.53 34.63,59.98 CC_X0.3 32.4,59.98 32.4,59.71 31.5,58.81 27.23,58.81 CC0.MOSI | 34.03,99.56 32.08,97.61 CC2.MOSI | 34.03,99.56 34.03,100.54 33.16,101.41 32.88,101.41 CC_X2.3 | 34.03,99.56 35.94,97.65 42.88,97.65 43.88,98.65 43.88,99.19 44.49,99.81 62.69,99.81 66.05,103.17 CC_X4.3 67.17,104.28 67.45,104.28 68.29,105.12 68.29,105.9 69.41,107.03 73.17,107.03 74.1,106.09 74.1,104.91 CC4.MOSI | CC1.MOSI 73.47,69.35 73.47,69.14 70.52,66.18 69.13,66.18 68.29,65.34 68.29,65.06 CC_X1.3
  Bottom 0.406: 67.17,65.62 47.95,65.62 43.85,61.52 v35.62,61.52 | 67.17,65.62 67.17,66.18 67.44,66.18 68.44,67.18 68.44,72.36 71.37,75.29 71.37,92.8 70.28,93.9 69.77,93.9 68.29,95.38 68.29,101.21 67.45,102.05 67.17,102.05 CC_X4.3 | CC_X1.3 67.17,65.62 | CC_X2.3 32.88,101.41 33.15,101.41 36.37,98.19 U$1.26
MOSI-A
  Top 0.406: U$2.D11 85.79,81.78 65.86,81.78 64.95,82.7 61.01,82.7 60.19,81.88 60.19,80.31 NRF24L01+.6
N$1
  Top 0.406: X3.1 4.43,99.99 4.43,101.14 4.94,101.65 CC2.ANT
N$2
  Top 0.406: CC4.ANT 95.75,100.87 95.75,100.11 95.62,99.99 X4.1
N$3
  Top 0.406: X1.1 94.99,66.97 94.99,66.51 CC1.ANT
N$4
  Top 0.406: CC0.ANT 4.94,64.82 4.43,65.33 4.43,66.97 X2.1
N$5  (1 unrouted)
N$15  (1 unrouted)
NRESET  (via drill 0.3 pad 0.61)
  Top 0.406: CTX-DB.10 38.59,57.96 35.91,57.96 v35.31,58.56
  Bottom 0.406: U$1.34 16.05,82.11 19.99,78.18 19.99,69.38 30.5,58.87 35,58.87 v35.31,58.56
RES'  (2 unrouted)
RST
  Top 0.406: W5100.5 42.41,99.79 42.54,99.79 43.58,100.83 43.58,101.42 44.49,102.33 60.29,102.33 66.69,108.72 66.69,108.88 W5500NIREN.6
  Bottom 0.406: U$1.17 41.45,76.47 40.34,77.58 40.34,95.68 42.31,97.65 42.41,97.65 W5100.5
RX1
  Bottom 0.406: UART1.3 42.72,72.37 42.72,90.92 43.53,91.73 44.63,91.73 U$1.22
RX-MAPLE  (via drill 0.3 pad 0.61)
  Top 0.406: U$2.TX0-1 65.93,86.05 v38.67,86.05 29.99,86.05 U$1.30
  Bottom 0.406: UART0.3 38.69,67.51 38.69,70.69 40.06,72.06 40.06,76.19 38.67,77.58 v38.67,86.05
RX_DBG
  Top 0.406: U$1.14 31.61,72.37 DBG.3
RX_LED  (1 unrouted)
SCK  (1 unrouted)
SCK1  (via drill 0.3 pad 0.61)
  Top 0.406: CC_X4.4 70.83,103.17 71.08,102.91 CC4.SCLK | CC0.SCLK 26.58,62.78 26.58,63.76 v26.74,63.91 | CC1.SCLK 73.47,67.35 71.18,65.06 CC_X1.4 | CC2.SCLK 23.94,99.61 23.94,102.19 24.28,102.53 CC_X2.4
  Bottom 0.406: 30.97,61.1 35.11,61.1 35.35,60.86 44.98,60.86 48.07,63.95 67.75,63.95 68.59,64.79 68.59,65.06 CC_X1.4 69.71,66.18 69.98,66.18 73.9,70.1 73.9,98.14 69.99,102.05 69.71,102.05 CC_X4.4 | 30.97,61.1 29.54,61.1 v26.74,63.91 22.4,68.25 22.4,78.28 17.46,83.21 17.46,91.09 18.31,91.94 29.18,91.94 | 29.18,91.94 U$1.28 | 29.18,91.94 29.18,100.53 30.07,101.41 30.34,101.41 CC_X2.4 | CC_X0.4 30.97,61.1
SCK2  (via drill 0.3 pad 0.61)
  Top 0.406: W5100.6 49.81,98.72 v53.41,95.12
  Bottom 0.406: v53.41,95.12 53.41,76.57 49.51,72.67 48.45,72.67 U$1.19 | W5500NIREN.10 61.61,108.88 51.45,98.72 W5100.6
SCK-A  (via drill 0.3 pad 0.61)
  Top 0.406: U$2.D13 88.32,89.39 66.35,89.39 v64.89,87.93
  Bottom 0.406: v64.89,87.93 58.91,81.96 NRF24L01+.5
SWCLK/TCK
  Top 0.406: CTX-DB.4 42.41,54.84 41.81,54.25 25.09,54.25 17.43,61.91 17.43,75.78 18.17,76.51 21.75,76.51 U$1.10
SWDIO/TMS
  Top 0.406: CTX-DB.2 43.67,57.96 40.85,57.96 37.66,61.14 37.66,62.5 33.83,66.33 33.16,66.33 32.4,67.1 32.4,67.77 30.78,69.38 28.7,69.38 26.21,71.87 U$1.11
SWO/TDO
  Top 0.406: CTX-DB.6 41.13,54.84 25.3,54.84 18.59,61.56 U$1.8
TDI
  Top 0.406: U$1.9 21.13,69.03 24.22,65.94 27.82,65.94 29.96,63.8 34.29,63.8 36.28,61.8 36.28,61.54 39.86,57.96 CTX-DB.8
TX1
  Bottom 0.406: U$1.23 45.12,88.7 45.12,73.38 42.41,70.66 UART1.2
TX-MAPLE
  Top 0.406: U$2.RX1-1 28.12,85.39 U$1.31
  Bottom 0.406: UART0.2 43.67,67.61 43.67,70.59 44.49,71.4 50.32,71.4 57.48,78.57 57.48,79.19 58.76,80.47 59.43,80.47 60.19,81.22 60.19,81.89 63.68,85.39 U$2.RX1-1
TX_DBG
  Top 0.406: U$1.15 34.15,72.37 DBG.2
VCC  (via drill 0.3 pad 0.61)  (2 unrouted)
  Top 0.406: v40.92,60.09 43.03,60.09 43.67,60.74 CTX-DB.1 43.67,65.06 UART0.1 | CC_X1.1 CC_X1.2 69.71,70.3 | DBG.1 43.04,71.42 UART1.1 | CC_X0.1 CC_X0.2 27.25,57.45 26.58,56.78 CC0.VCC 23.93,58.11 23.93,61.36 24.11,61.54 26.46,61.54 26.69,61.31 26.69,60.3 C1.2 | CC4.VCC 74.1,108.91 74.1,108.43 73.37,107.7 69.16,107.7 CC_X4.1 | 7.32,87.93 13.99,87.93 14.78,88.73 14.78,90.94 17.45,93.61 CC2.VCC 26.58,93.61 26.58,93.44 26.69,93.33 C3.2 28.91,93.33 29.22,93.64 C5.1 | 7.32,87.93 4.94,85.55 2.08,85.55 C6.1 1.08,86.66 0.81,86.92 U$1.40 | 7.32,87.93 7.32,91.08 14.62,98.37 27.6,98.37 29.22,99.99 CC_X2.2 CC_X2.1 | C7.2 67.56,72.69 67.56,71.64 68.91,70.3 69.71,70.3 | 69.71,70.3 71.14,71.73 C2.2 72.25,72.74 72.85,72.74 73.47,73.35 CC1.VCC | C4.2 71.14,106.02 70.83,105.7 CC_X4.2
  Bottom 0.406: v40.92,60.09 38.27,57.45 CC_X0.1 | UART0.1 UART1.1 62.1,69.51 63.99,71.41 | 63.99,71.41 NRF24L01+.2 66.53,81.58 68.63,81.58 69.49,82.44 69.49,85.79 68.62,86.66 66.99,86.66 66.04,87.6 66.04,103.73 66.9,104.59 67.17,104.59 67.17,105.15 | 63.99,71.41 66.68,68.72 67.17,68.72 CC_X1.1 | CC_X4.1 67.17,105.15 | 69.71,105.15 69.71,104.59 69.98,104.59 77.97,96.61 U$2.VCC | CC_X4.2 69.71,105.15 | 69.71,105.15 67.17,105.15 | CC_X2.1 32.88,98.87 35.1,96.65 35.1,73 DBG.1
WIZ_CS
  Bottom 0.406: U$1.20 49.07,76.47 47.96,77.58 47.96,95.07 | 47.96,95.07 44.45,95.07 43.47,96.05 43.47,96.18 W5100.3 | 47.96,95.07 50.55,95.07 64.15,108.66 64.15,108.88 W5500NIREN.8
WIZ_RST
  Bottom 0.406: 43.86,99.79 41.9,99.79 37.76,95.64 37.76,75.74 U$1.16 | 43.86,99.79 46.59,99.79 57.11,110.3 65.85,110.3 66.69,111.14 66.69,111.42 W5500NIREN.5 | 43.86,99.79 43.86,98.2 44.81,97.25 44.95,97.25 W5100.4

### Text on the board
tNames: GND | +5V | VCC | GND | AV+ | LAN | VCC | IN | RST | GND | IN | SCK | OUT | SCK | OUT | SCK | CS | MOSI | MISO | MISO | CS | MISO | CS | MOSI | MOSI | VCC | VCC | TX | NRST | TX | RX | RX | NSS | GND | GND | GND | GND | VCC | MO | 5V | LAN | MOSI | MOSI | GND | RST | SCK | CS | MISO | MISO | CS | MISO | OUT | SCK | OUT | SCK | IN | IN | 31 (PB12) | VIN | GND | VCC | VCC
bNames: VCC | AV+ | 31 (PB12) | VIN